# EAGLE design ChristmasTree (EAGLE 9.6.2)
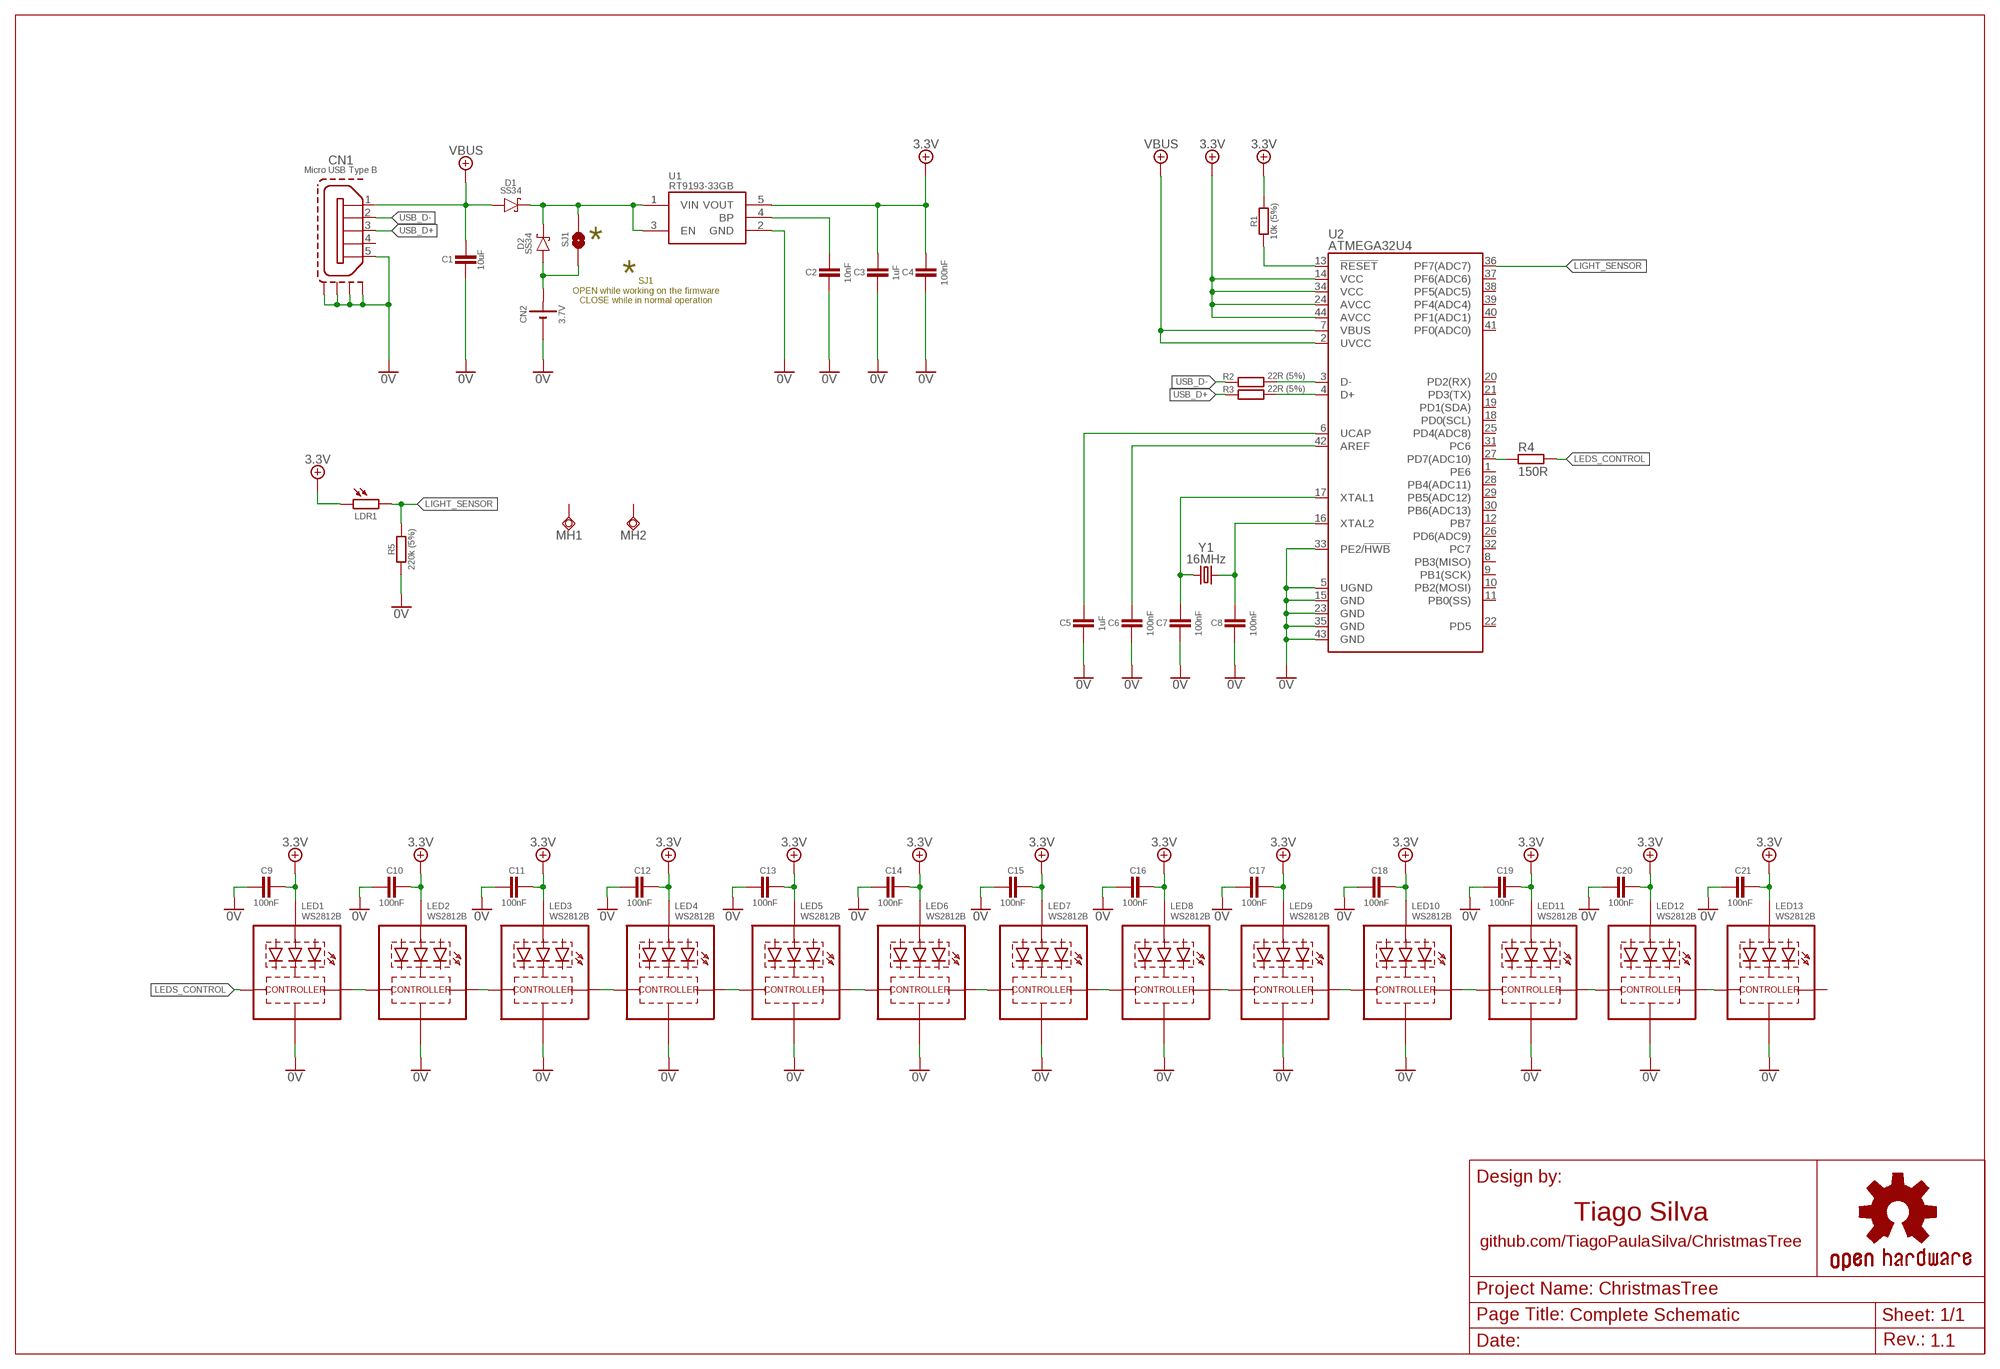
[diagram p0: schematic, sheet 1]

## Parts
C1  10uF  C_0805  [C0805]
C2  10nF  C_0603  [C0603]
C3  1uF  C_0603  [C0603]
C4  100nF  C_0603  [C0603]
C5  1uF  C_0603  [C0603]
C6  100nF  C_0603  [C0603]
C7  100nF  C_0603  [C0603]
C8  100nF  C_0603  [C0603]
C9  100nF  C_0603  [C0603]
C10  100nF  C_0603  [C0603]
C11  100nF  C_0603  [C0603]
C12  100nF  C_0603  [C0603]
C13  100nF  C_0603  [C0603]
C14  100nF  C_0603  [C0603]
C15  100nF  C_0603  [C0603]
C16  100nF  C_0603  [C0603]
C17  100nF  C_0603  [C0603]
C18  100nF  C_0603  [C0603]
C19  100nF  C_0603  [C0603]
C20  100nF  C_0603  [C0603]
C21  100nF  C_0603  [C0603]
CN1  Micro USB Type B  MICRO-USB  [10118193-0001LF]
CN2  3.7V  CELL-CONNECTOR  [JST-PH2]
D1  SS34  [DO214AB]
D2  SS34  [DO214AB]
LDR1  A1050_09  [T0-46-A10XX]
LED1  WS2812B  [5050]
LED2  WS2812B  [5050]
LED3  WS2812B  [5050]
LED4  WS2812B  [5050]
LED5  WS2812B  [5050]
LED6  WS2812B  [5050]
LED7  WS2812B  [5050]
LED8  WS2812B  [5050]
LED9  WS2812B  [5050]
LED10  WS2812B  [5050]
LED11  WS2812B  [5050]
LED12  WS2812B  [5050]
LED13  WS2812B  [5050]
MH1  TPSQTP20R  [TP20R]
MH2  TPSQTP20R  [TP20R]
R1  10k (5%)  R_0603  [R0603]
R2  22R (5%)  R_0603  [R0603]
R3  22R (5%)  R_0603  [R0603]
R4  150R  R_0603  [R0603]
R5  220k (5%)  R_0603  [R0603]
SJ1  SJ  [SJ]
U1  RT9193-33GB  [SOT94P279X129-5N]
U2  ATMEGA32U4  TESTING_ATMEGA32U4QFN  [TESTING_QFN-44]
Y1  16MHz  KX-9A  [5.0X3.2_KX-9A]

## Nets
0V: C1.2 C2.2 C3.2 C4.2 C5.2 C6.2 C7.2 C8.2 C9.2 C10.2 C11.2 C12.2 C13.2 C14.2 C15.2 C16.2 C17.2 C18.2 C19.2 C20.2 C21.2 CN1.5 CN1.MP1(S1) CN1.MP2(S2) CN1.MP3(S3) CN1.MP4(S4) CN2.2(-) LED1.3-GND(GND) LED2.3-GND(GND) LED3.3-GND(GND) LED4.3-GND(GND) LED5.3-GND(GND) LED6.3-GND(GND) LED7.3-GND(GND) LED8.3-GND(GND) LED9.3-GND(GND) LED10.3-GND(GND) LED11.3-GND(GND) LED12.3-GND(GND) LED13.3-GND(GND) R5.1 U1.2(GND) U2.5(UGND) U2.15(GND) U2.23(GND) U2.33(PE2/!HWB) U2.35(GND) U2.43(GND)
3.3V: C3.1 C4.1 C9.1 C10.1 C11.1 C12.1 C13.1 C14.1 C15.1 C16.1 C17.1 C18.1 C19.1 C20.1 C21.1 LDR1.1 LED1.1-VDD(VDD) LED2.1-VDD(VDD) LED3.1-VDD(VDD) LED4.1-VDD(VDD) LED5.1-VDD(VDD) LED6.1-VDD(VDD) LED7.1-VDD(VDD) LED8.1-VDD(VDD) LED9.1-VDD(VDD) LED10.1-VDD(VDD) LED11.1-VDD(VDD) LED12.1-VDD(VDD) LED13.1-VDD(VDD) R1.2 U1.5(VOUT) U2.14(VCC) U2.24(AVCC) U2.34(VCC) U2.44(AVCC)
LEDS_CONTROL: LED1.4-DIN(DI) R4.2
LIGHT_SENSOR: LDR1.2 R5.2 U2.36(PF7(ADC7))
N$1: LED3.2-DOUT(DO) LED4.4-DIN(DI)
N$2: LED1.2-DOUT(DO) LED2.4-DIN(DI)
N$3: R4.1 U2.27(PD7(ADC10))
N$4: LED2.2-DOUT(DO) LED3.4-DIN(DI)
N$5: LED5.2-DOUT(DO) LED6.4-DIN(DI)
N$6: LED8.2-DOUT(DO) LED9.4-DIN(DI)
N$7: LED6.2-DOUT(DO) LED7.4-DIN(DI)
N$8: LED10.2-DOUT(DO) LED11.4-DIN(DI)
N$9: LED9.2-DOUT(DO) LED10.4-DIN(DI)
N$10: LED12.2-DOUT(DO) LED13.4-DIN(DI)
N$11: LED4.2-DOUT(DO) LED5.4-DIN(DI)
N$12: R3.2 U2.4(D+)
N$13: LED11.2-DOUT(DO) LED12.4-DIN(DI)
N$14: LED7.2-DOUT(DO) LED8.4-DIN(DI)
N$15: C7.1 U2.17(XTAL1) Y1.1
N$16: C8.1 U2.16(XTAL2) Y1.3
N$17: C5.1 U2.6(UCAP)
N$18: C6.1 U2.42(AREF)
N$19: CN2.1(+) D2.A SJ1.1
N$20: R2.2 U2.3(D-)
N$21: C2.1 U1.4(BP)
RESET: R1.1 U2.13(!RESET)
USB_D+: CN1.3 R3.1
USB_D-: CN1.2 R2.1
VBAT: D1.C(K) D2.C(K) SJ1.2 U1.1(VIN) U1.3(EN)
VBUS: C1.1 CN1.1 D1.A U2.2(UVCC) U2.7(VBUS)
Unconnected: CN1.4 LED13.2-DOUT(DO) MH1.TP MH2.TP U2.1(PE6) U2.8(PB3(MISO)) U2.9(PB1(SCK)) U2.10(PB2(MOSI)) U2.11(PB0(SS)) U2.12(PB7) U2.18(PD0(SCL)) U2.19(PD1(SDA)) U2.20(PD2(RX)) U2.21(PD3(TX)) U2.22(PD5) U2.25(PD4(ADC8)) U2.26(PD6(ADC9)) U2.28(PB4(ADC11)) U2.29(PB5(ADC12)) U2.30(PB6(ADC13)) U2.31(PC6) U2.32(PC7) U2.37(PF6(ADC6)) U2.38(PF5(ADC5)) U2.39(PF4(ADC4)) U2.40(PF1(ADC1)) U2.41(PF0(ADC0))

## Notes on the sheet
- *
- *
- SJ1
  OPEN while working on the firmware
  CLOSE while in normal operation
- .
- .
- Tiago Silva
- github.com/TiagoPaulaSilva/ChristmasTree
- Complete Schematic
- 1.1

## Library data of the parts
C1-C21 = My-RLC:C_: NON-POLARIZED CAP
CN1 = My-Connectors:MICRO-USB: Micro USB Type B Connector - Standard, Shell Through Hole Source: http://www.hirose.co.jp/cataloge_hp/ed_ZX_20140804.pdf; PN: 10118193-0001LF
CN2 = My-Battery:CELL-CONNECTOR
D1 D2 = My-Diodes:SS34
LDR1 = photo-elements:A10: Sensor Robust Light Sensing Applications Outdoor Light Sensing Application Source: http://optoelectronics.perkinelmer.com/content/Datasheets/DTS_PhotocellsA1050.pdf
LED1-LED13 = My-LED:WS2812B: Intelligent control circuit and RGB chip integrated in a single 5050 package, providing a complete control of pixel point
MH1 MH2 = testpad:TPSQ: Test pad
R1-R5 = My-RLC:R_: RESISTOR
SJ1 = jumper:SJ: SMD solder JUMPER
U1 = RT9193-33GB:RT9193-33GB: RT9193 Series 300 mA 3.3 V Ultra-Low Noise Ultra-Fast CMOS LDO Regulator-SC-70-5; AVAILABILITY: Unavailable; DESCRIPTION: Linear Voltage Regulator IC 1 Output 300mA SOT-23-5; MF: Richtek USA; MP: RT9193-33GB; PACKAGE: SOT-23-5 Richtek; PRICE: None
U2 = SparkFun_Pro_Micro_v13a:TESTING_ATMEGA32U4: Atmel 44-pin 8-bit Microcontroller with 32KBytes of ISP Flash and USB Controller
Y1 = crystal-geyer_V1_0:KX: Quartz Crystals (MHz) SMD: KX - Serie Model Size l/w/h [mm] Frequency Range Frequency Stability Temp. Range [°C] Load Capacitance AECQ 200 availabel Datasheet KX-4 KX-5 KX-6 KX-7 KX-9A KX-9B KX-12A KX-12B KX-13 KX-20 KX-K KX-KS 1.6/1.2/0.3 2.0/1.6/0.45 2.5/2.0/0.55 3.2/2.5/0.8 5.0/3.2/1.0 5.0/3.2/1.1 6.0/3.5/1.1 6.0/3.5/1.0 7.0/5.0 /1.3 11.6/5.5/1.6 12.3/4.5/4.2 12.3/4.5/3.2 24.0 ~ 80.0 MHz 16.0 ~ 80.0 MHz 12.0 ~ 80.0 MHz 8.0 ~ 60.0 MHz 7,68 ~ 300,0 MHz 8,0 ~ 50,0 MHz 8,0 ~ 150,0 MHz 8,0 ~ 50,0 MHz 6,0 ~ 160,0 MHz 3,579 ~ 25,0 MHz 3,579 ~ 70,0 MHz 3,579 ~ 70,0 MHz ±10 … ±50ppm ±10 … ±50ppm ±10 … ±50ppm ±10 … ±50ppm ±10 … ±50ppm ±10 … ±50ppm ±10 … ±50ppm ±10 … ±50ppm ±10 … ±50ppm ±50ppm ±10 … ±50ppm ±10 … ±50ppm (*) -40°C …+85°C (*) -40°C …+125°C (*) -40°C …+125°C (*) -40°C …+125°C (*) -40°C …+105°C (*) -40°C …+105°C (*) -40°C …+125°C (*) -40°C …+105°C (*) -40°C …+105°C (*) -40°C …+105°C (*) -40°C …+85°C (*) -40°C …+85°C 8, 8…16 8, 8…16 10, 8…16 12, 7…20 16, 10…20 16, 10…20 16, 10…20 16, 12…20 16, 12…20 16, 12…20 16, 12…30 16, 12…30 - yes yes yes - - - - - - - - KX-4.pdf <http://www.geyer-electronic.de/uploads/tx_userartikelfrequenz/GEYER-KX-4.pdf> KX-5.pdf <http://www.geyer-electronic.de/uploads/tx_userartikelfrequenz/GEYER-KX-5.pdf> KX-6.pdf <http://www.geyer-electronic.de/uploads/tx_userartikelfrequenz/GEYER-KX-6.pdf> KX-7.pdf <http://www.geyer-electronic.de/uploads/tx_userartikelfrequenz/GEYER-KX-7.pdf> KX-9A.pdf <http://www.geyer-electronic.de/uploads/tx_userartikelfrequenz/GEYER-KX-9A.pdf> KX-9B.pdf <http://www.geyer-electronic.de/uploads/tx_userartikelfrequenz/GEYER-KX-9B.pdf> KX-12A.pdf <http://www.geyer-electronic.de/uploads/tx_userartikelfrequenz/GEYER-KX-12A.pdf> KX-12B.pdf <http://www.geyer-electronic.de/uploads/tx_userartikelfrequenz/GEYER-KX-12B.pdf> KX-13.pdf <http://www.geyer-electronic.de/uploads/tx_userartikelfrequenz/GEYER-KX-13.pdf> KX-20.pdf <http://www.geyer-electronic.de/uploads/tx_userartikelfrequenz/GEYER-KX-20.pdf> KX-K.pdf <http://www.geyer-electronic.de/uploads/tx_userartikelfrequenz/GEYER-KX-K.pdf> KX-KS.pdf <http://www.geyer-electronic.de/uploads/tx_userartikelfrequenz/GEYER-KX-KS.pdf> <http://www.geyer-electronic.de/fileadmin/template/img/logo-geyer-electronic.png> Details see: http://www.geyer-electronic.de/Frequenz-Produkte.9.0.html Created 2016-06-07, Hans Locher 2016 (C) Geyer Quartz Technology KX4,KX5,KX6,KX7,KX9A,KX9B,KX12A,KX12B,KX13,KX20,KXK,KXKS;1612;2016;2520;3225;5032;6035;7050;11655;12345;1,6x1,2;2,0x1,6;2,5x2,0;3,2x2,5;5,0x3,2;6,0x3,5;7,0x5,0;11,6x5,5;12,3x4,5;12,3x4,5;1.6x1.2;2.0x1.6;2.5x2.0;3.2x2.5;5.0x3.2;6.0x3.5;7.0x5.0;11.6x5.5;12.3x4.5;12.3x4.5;

## Net classes
0 default: width 0.203 mm

## Board
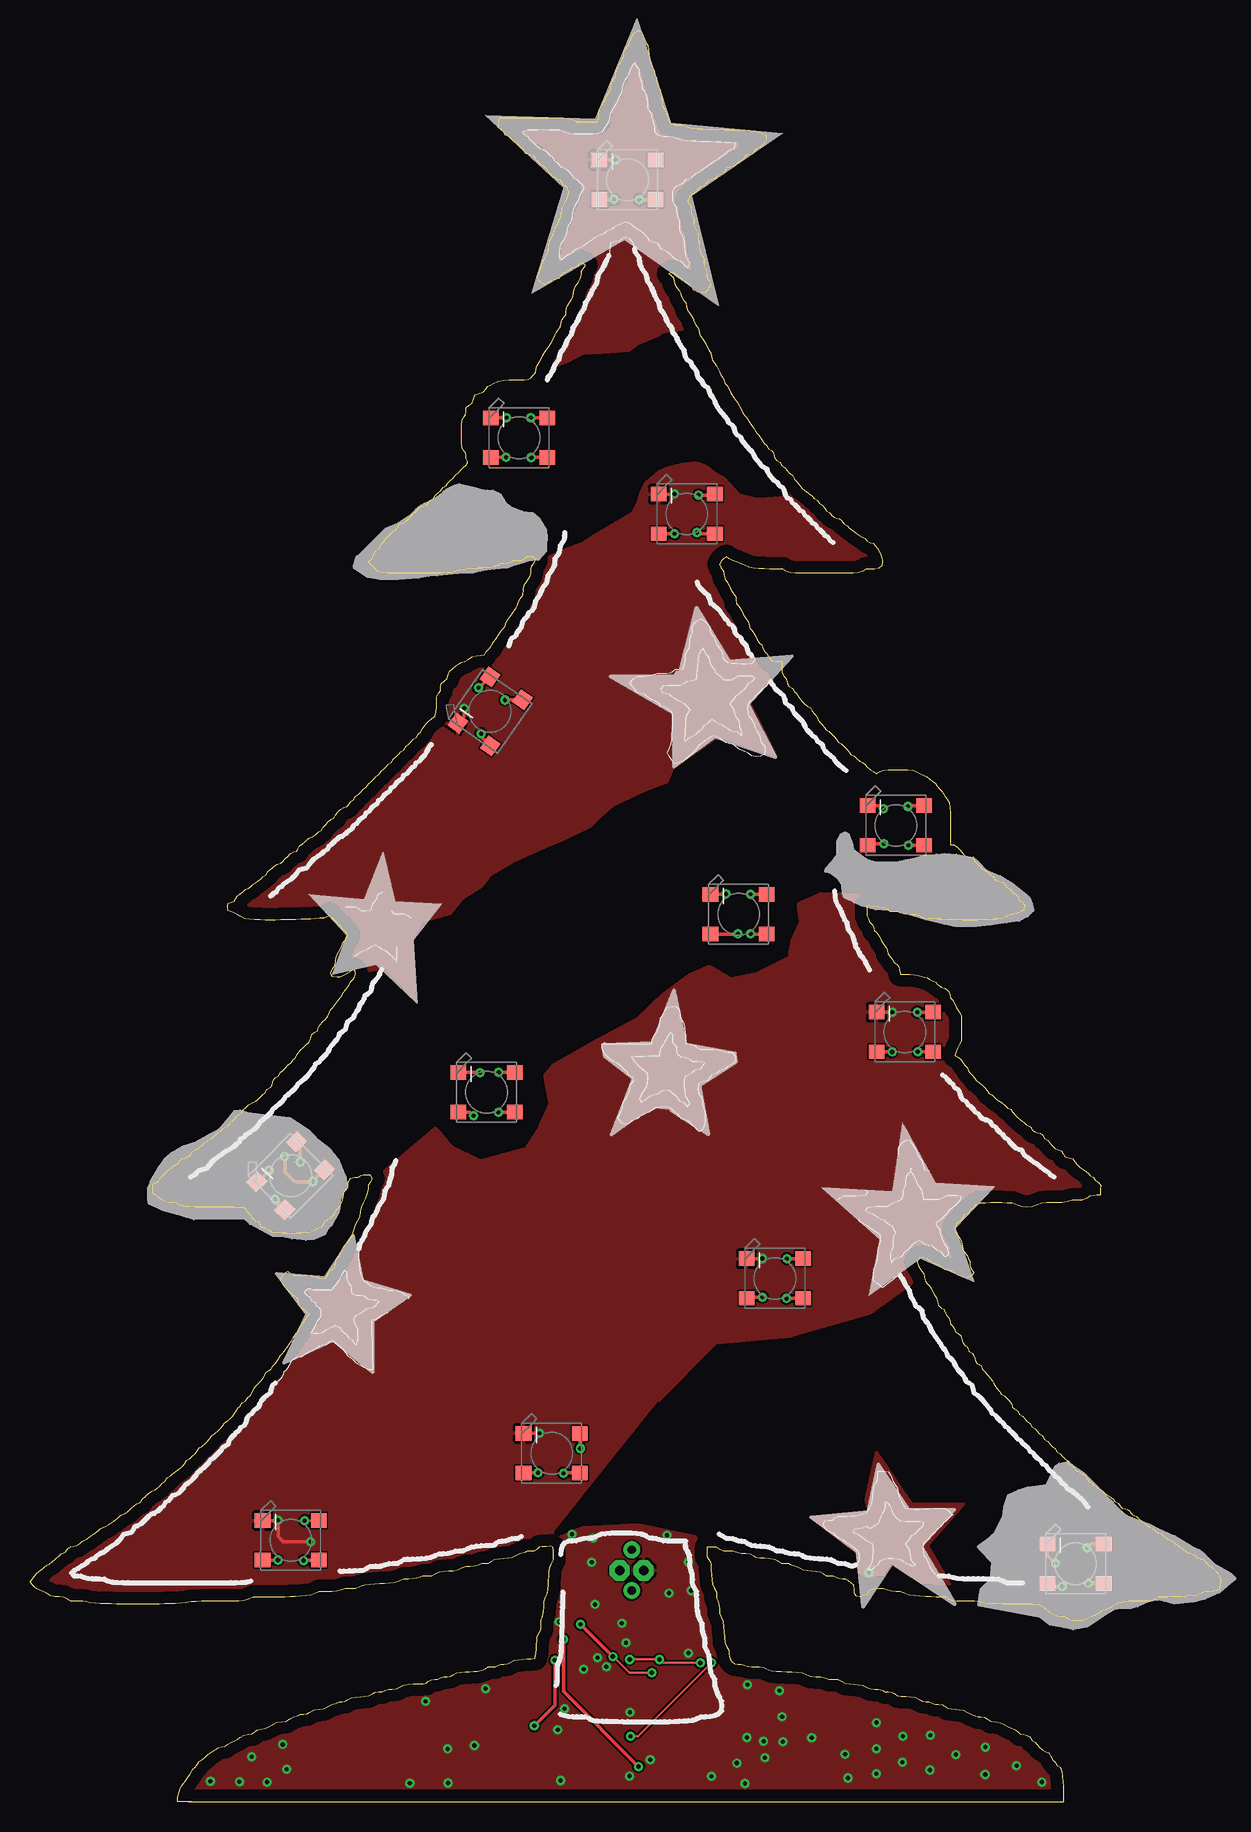
[diagram p1: board, top side]
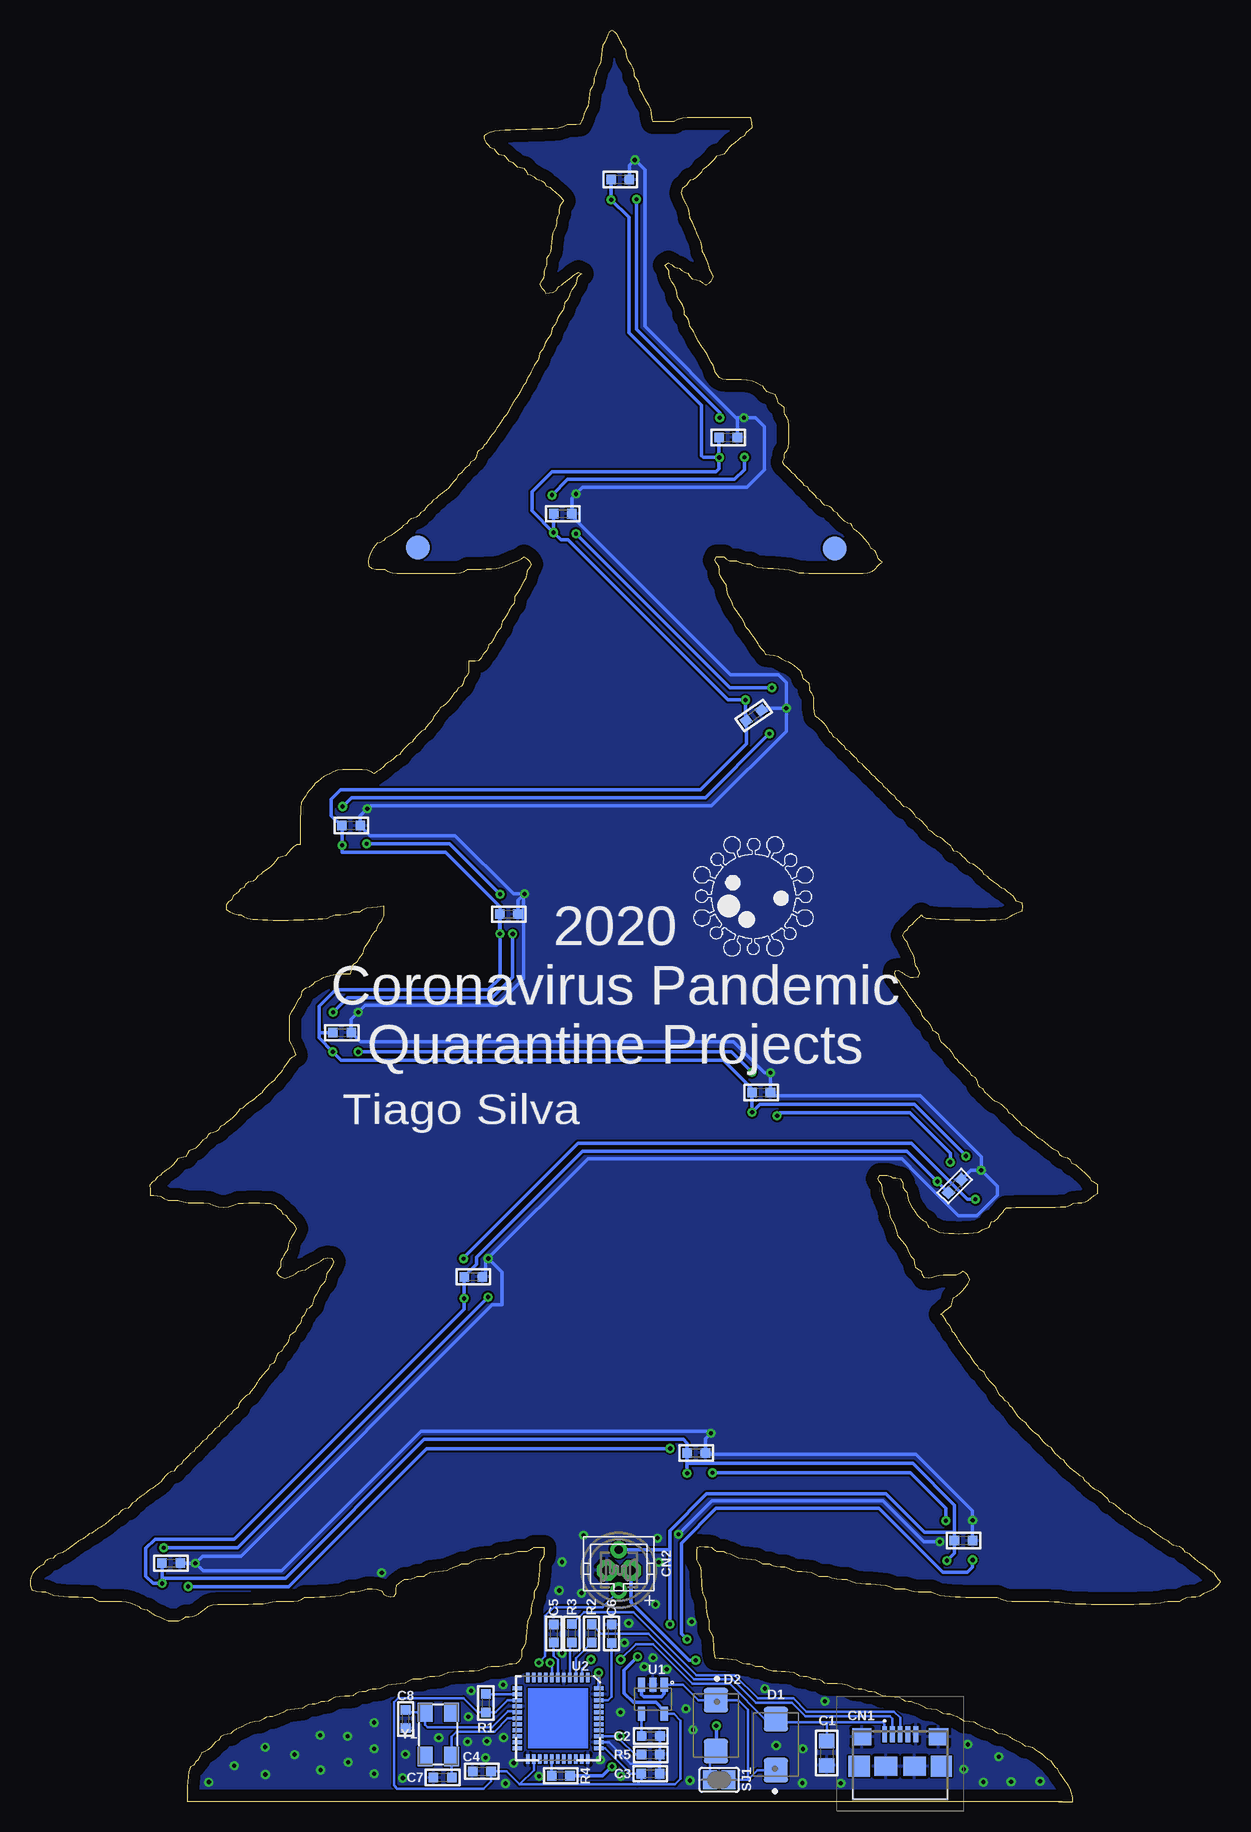
[diagram p2: board, bottom side, seen from below]

Size 99.25 x 147.66 mm. Coordinates in mm from the lower left corner, seen from the top.
Outline: 2001 segments
Copper layers (1*16): Top 0.035mm / dielectric 1.5mm / Bottom 0.035mm
Design rules "default *": minimum track width 6mil, minimum drill 0.35mm, track to track 6mil, track to pad 6mil, pad to pad 6mil, via to via 6mil, smd to smd 6mil, copper to edge 40mil, drill to drill 6mil, minimum pad ring 10mil, minimum via ring 8mil, stop-mask expansion 4mil, vias tented up to drill 15mil, thermal gap 10mil
tKeepout: area 52.9,88.3 to 60.6,96.4
tRestrict: area 43.7,15.6 to 69.4,33.3; area 52.4,23.8 to 69.8,38.7; area 69.4,15.6 to 77.1,19.8; area 63.7,15.1 to 99.6,43.7; area 10.1,47 to 83.2,93.8; area 27.4,102.2 to 64.5,122.5

### Footprints (pad centres in the part's own frame; a part is rotated, then mirrored left to right if it is on the bottom)
C0805 = smd 1.2 x 1.3: 1 -1.016,0; 2 1.016,0
C0603 = smd 0.8 x 0.8: 1 -0.762,0; 2 0.762,0
10118193-0001LF = smd 1.35 x 0.4: 1 1.33,1.3; 2 1.33,0.65; 3 1.33,0; 4 1.33,-0.65; 5 1.33,-1.3 | smd 1.4 x 1.6: MP1 1.105,3.2; MP4 1.105,-3.2 | smd 1.6 x 1.9: MP2 -1.345,1.2; MP3 -1.345,-1.2 | smd 1.778 x 1.778: P$1 -1.346,3.429; P$2 -1.346,-3.429
JST-PH2 = drill 0.813 pad 1.676 octagon: 1 1,0; 2 -1,0
DO214AB = smd 2.06 x 2.02: A 2.125,0; C -2.125,0
T0-46-A10XX = drill 0.7 pad 1.4: 1 -1.7,0; 2 1.7,0
5050 = smd 1.3 x 1.2: 1-VDD 2.35,-1.65; 2-DOUT 2.35,1.65; 3-GND -2.35,1.65; 4-DIN -2.35,-1.65
TP20R = smd 2 x 2: TP 0,0
R0603 = smd 0.8 x 0.8: 1 -0.762,0; 2 0.762,0
SJ = smd 1.168 x 1.6: 1 -0.762,0; 2 0.762,0
SOT94P279X129-5N = smd 1.17 x 0.67: 1 -1.22,0.94; 2 -1.22,0; 3 -1.22,-0.94; 4 1.22,-0.94; 5 1.22,0.94
TESTING_QFN-44 = smd 0.8 x 0.3: 1 -3.4,2.5; 2 -3.4,2; 3 -3.4,1.5; 4 -3.4,1; 5 -3.4,0.5; 6 -3.4,0; 7 -3.4,-0.5; 8 -3.4,-1; 9 -3.4,-1.5; 10 -3.4,-2; 11 -3.4,-2.5; 23 3.4,-2.5; 24 3.4,-2; 25 3.4,-1.5; 26 3.4,-1; 27 3.4,-0.5; 28 3.4,0; 29 3.4,0.5; 30 3.4,1; 31 3.4,1.5; 32 3.4,2; 33 3.4,2.5 | smd 0.3 x 0.8: 12 -2.5,-3.4; 13 -2,-3.4; 14 -1.5,-3.4; 15 -1,-3.4; 16 -0.5,-3.4; 17 0,-3.4; 18 0.5,-3.4; 19 1,-3.4; 20 1.5,-3.4; 21 2,-3.4; 22 2.5,-3.4; 34 2.5,3.4; 35 2,3.4; 36 1.5,3.4; 37 1,3.4; 38 0.5,3.4; 39 0,3.4; 40 -0.5,3.4; 41 -1,3.4; 42 -1.5,3.4; 43 -2,3.4; 44 -2.5,3.4
5.0X3.2_KX-9A = smd 1.6 x 1.25: 1 -1.85,-1.1; 2 1.85,-1.1; 3 1.85,1.1; 4 -1.85,1.1

### Placement (x,y rotation side)
C1  32.83,4.07 270 bottom
C2  47.49,5.5 0 bottom
C3  47.53,2.35 0 bottom
C4  61.58,2.55 180 bottom
C5  55.59,14.04 90 bottom
C6  50.76,14.02 90 bottom
C7  64.85,2.03 180 bottom
C8  67.94,6.91 270 bottom
C9  21.42,21.78 0 bottom
C10  43.7,29.09 0 bottom
C11  87.48,19.89 0 bottom
C12  62.29,43.76 0 bottom
C13  73.24,64.1 0 bottom
C14  59.32,73.98 0 bottom
C15  38.29,59.12 0 bottom
C16  22.15,51.31 45 bottom
C17  72.48,81.36 0 bottom
C18  38.92,90.53 35 bottom
C19  54.83,107.35 0 bottom
C20  41.04,113.71 0 bottom
C21  50.04,135.19 0 bottom
CN1  26.7,4.32 90 bottom
CN2  50.16,19.29 0 bottom
D1  37.06,4.77 90 bottom
D2  42.07,6.36 270 bottom
LDR1  50.17,19.32 270 bottom
LED1  21.75,21.8 0 top
LED2  43.5,29.06 0 top
LED3  87.17,19.86 0 top
LED4  62.09,43.62 0 top
LED5  21.74,52.19 45 top
LED6  38.06,59.14 0 top
LED7  72.93,64.17 0 top
LED8  59.08,73.97 0 top
LED9  72.19,81.38 0 top
LED10  38.36,90.88 55 top
LED11  54.75,107.33 0 top
LED12  40.77,113.69 0 top
LED13  49.82,135.18 0 top
MH1  32.18,104.47 0 bottom
MH2  66.91,104.54 0 bottom
R1  61.26,8.22 270 bottom
R2  52.43,14.04 270 bottom
R3  54.09,14.05 270 bottom
R4  54.99,2.19 0 bottom
R5  47.51,3.96 180 bottom
SJ1  41.8,1.85 0 bottom
U1  47.32,8.56 270 bottom
U2  55.24,6.97 270 bottom
Y1  65.22,5.63 90 bottom

### Tracks (layer width: path | path; a pad name or v marks a point on that pad's centre or on a via)
0V  (via drill 0.35)
  Top 0.305: LED1.3-GND 20.66,23.45 v20.67,23.46 20.67,22.12 21.11,21.68 v23.4,21.68 | LED2.3-GND v42.46,30.71 v42.47,30.73 | v85.47,19.89 84.82,20.54 LED3.3-GND | LED4.3-GND 61.03,45.27 v61.05,45.29 | LED6.3-GND 37.51,60.79 v37.53,60.77 | LED7.3-GND v71.87,65.82 v71.88,65.81 | LED8.3-GND 57.98,75.62 v58.03,75.67 | LED9.3-GND 70.87,83.03 v71.13,82.76 | LED10.3-GND 36.2,90.44 v36.2,91.15 | LED11.3-GND 53.71,108.98 v53.72,109 | LED12.3-GND v39.72,115.34 v39.73,115.35 | LED13.3-GND v48.82,136.83 v48.83,136.83 | v19.96,52.65 19,51.69 LED5.3-GND
  Bottom 0.203: C3.2 46.75,2.36 46.75,3.19 | 46.75,3.19 R5.1 46.75,5.48 C2.2 | 46.75,3.19 49.21,3.19 51,4.98 U2.35
  Bottom 0.305: C21.2 49.28,136.38 v48.83,136.83 48,136 48,122.96 40.39,115.35 v39.73,115.35 | C20.2 40.27,115.35 v39.73,115.35 | C18.2 38.11,91.15 v36.2,91.15 | C14.2 58.56,75.13 v58.03,75.67 | C13.2 72.48,65.21 v71.88,65.81 | C12.2 61.28,44.01 61.28,45.06 v61.05,45.29 | C9.2 v20.67,23.46 20.67,24.25 25.41,28.99 42.84,28.99 C10.2 42.94,30.26 v42.47,30.73 42.47,30.79 42.58,30.9 66.64,30.9 78.29,19.25 84.82,19.25 v85.47,19.89 C11.2 85.47,19.89 v85.47,19.89 84.86,20.49 81.65,20.49 60.72,41.42 59.9,41.42 59.9,44.14 v61.05,45.29 | v36.2,91.15 36.2,89.23 42.43,83 70.89,83 v71.13,82.76 71.72,82.18 C17.2 70.88,80.53 63.82,80.53 58.96,75.67 v58.03,75.67 | v39.73,115.35 38.79,115.35 38.02,114.59 38.02,111.01 39.48,109.55 53.18,109.55 v53.72,109 54.07,108.66 C19.2 54.07,107.15 40.86,93.94 36.87,93.94 36.2,93.28 v36.2,91.15 | v71.88,65.81 71.31,66.38 60.34,66.38 58.11,68.61 58.11,75.58 v58.03,75.67 | v71.88,65.81 72.47,65.22 72.47,64.13 71.67,63.33 40.6,63.33 38.04,60.77 v37.53,60.77 C15.2 37.24,58.84 25.02,58.84 19.96,53.77 v19.96,52.65 | v61.05,45.29 52.74,53.59 26.57,53.59 25.91,52.94 25.83,52.79 21.87,48.84 20.32,48.84 18.6,50.55 18.6,51.3 v19.96,52.65 | C16.2 20.81,52.65 v19.96,52.65 | v23.4,21.68 24.75,21.68 28.14,25.08 42.42,25.08 v45.2,22.3
  other vias: 70.57,4.43 70.57,2.34 70.57,6.62 72.78,5.47 72.73,3.32 75.07,5.55 75.02,2.66 77.2,3.94 79.65,4.57 79.62,2.28 82.24,3.02 62.77,5.02 84.34,1.66 58.92,3.24 59.76,5.37 61.16,5.07 61.27,3.68 59.6,1.54 51.71,3.52 37.04,4.7 44.24,1.79 44.56,7.77 43.99,6.02 50.02,7.46 47.3,12.01 49.68,13.26 49.34,14.9 59.81,9.76 62.48,9.25 62.7,7.1 65.17,5.35 68.18,1.99 67.95,3.97 15.04,1.72 17.46,1.69 19.77,1.65 18.49,3.76 21.08,4.79 21.4,2.73 34.85,1.58 34.8,4.42 31.66,1.55 32.99,8.38 37.97,9.44 49.98,2.16 56.81,2.13 44.09,15.02 47.12,16.46 46.83,19.98 46.93,21.99 53.11,22.22 54.89,19.99 53.27,17.41 55.13,17.62 48.05,11.27 46.16,11.05 54.9,12.4 69.93,19.1
  pour Bottom: 12.3,-0.01 86.08,-0.01 86.15,0.07 86.12,2.58 84.72,4.16 82.45,6.03 78.61,7.43 72.51,9.03 64.25,10.81 58.51,11.56 56.41,21.07 55.62,22.21 54.93,22.76 53.72,23.02 52.18,23.22 50.38,23.28 48.81,23.19 47.31,23.02 45.61,22.99 44.95,22.5 43.61,21.91 43.64,20.99 42.07,11.84 39.44,11.6 35.48,10.71 30.58,9.63 25.38,8.14 19.99,6.51 15.87,4.54 13.97,3.43 13.02,1.76 12.2,0.19 12.33,0
  pour Top: 12.29,-0.01 86.06,-0.01 86.13,0.06 86.11,2.58 84.71,4.15 82.44,6.02 78.59,7.42 72.49,9.02 64.23,10.8 58.5,11.55 56.39,21.06 55.61,22.2 54.92,22.75 53.71,23.01 52.17,23.21 50.37,23.27 48.8,23.18 47.29,23.01 45.59,22.98 44.94,22.49 43.6,21.9 43.63,20.98 42.06,11.83 39.43,11.6 35.47,10.7 30.56,9.62 25.36,8.13 19.98,6.5 15.85,4.53 13.96,3.42 13.01,1.75 12.19,0.18 12.32,-0.01
  pour Top: 56.4,21.24 57.22,21.24 57.76,20.92 58.86,20.73 60.17,20.56 60.55,20.37 61.91,20.18 63.41,19.67 64.48,19.31 65.62,19.16 66.36,18.99 67.29,18.67 68.06,18.52 68.57,18.31 68.86,17.53 68.9,17.16 69.67,17.04 70.09,17.52 70.9,17.71 72.46,17.49 73.49,17.22 74.72,17 75.81,16.97 77.14,16.64 78.32,16.59 79.79,16.53 80.66,16.34 81.64,16.4 82.71,16.43 83.99,16.48 85.05,15.88 85.62,15.44 87.15,14.93 88.13,15.04 89.11,15.5 89.93,15.96 90.75,16.51 92.19,16.64 93.83,16.7 94.38,17 95.93,17.08 97.48,17.22 98.79,17.57 99.42,18.14 99.23,18.82 98.85,19.37 98.22,19.86 97.46,20.27 96.28,20.84 94.65,22.07 93.94,22.53 91.98,24.03 90.86,24.74 87.67,27.54 86.31,28.58 83.22,31.47 80.61,34.63 78.26,37.6 76.87,39.54 75.59,41.77 74.36,43.76 73.98,44.93 74.25,45.31 74.5,45.31 75.02,44.96 75.95,44.5 76.52,44.25 77.14,44.03 77.88,43.65 78.7,43.98 78.32,45.67 77.85,46.27 77.25,47.6 77.47,48.53 78.37,49.46 79.16,49.92 81.1,49.97 82.32,49.81 83.28,49.54 84.62,50 85.95,49.95 87.23,50.14 88.21,50.16 88.54,50.55 89.55,50.46 89.5,50.9 89,51.74 87.91,52.73 86.55,53.71 85.51,54.47 80.66,58.56 78.75,60.47 77.12,62.24 77.72,63.41 77.64,64.91 77.14,66.54 76.11,67.77 75.05,68.56 73.71,68.97 72.59,69 71.17,71.2 70.41,72.78 69.76,74.56 70.96,74.47 71.96,74.2 73.76,73.82 75.51,73.41 77.88,73.33 79.41,73.38 81.53,73.68 82.13,74.12 83.01,74.34 82.9,75.07 82.13,75.81 81.23,76.33 80.2,77.23 79.46,77.74 78.59,78.56 77.94,78.78 77.25,79.54 76.52,79.73 76.78,82.48 76.42,83.89 75.87,84.67 75.08,85.26 74.46,85.68 73.51,86.01 72.14,86.08 70.93,85.98 70.5,85.59 67.76,87.91 65.4,90.46 63.57,92.78 62.65,94.19 62.88,95.07 61.7,95.07 59.02,99.72 57.78,102.43 57.81,103.44 58.3,103.54 59.15,103.05 59.71,102.76 62.03,102.56 63.47,102.4 64.58,102.33 66.32,102.3 68.38,102.3 69.59,102.46 70.21,102.79 70.73,102.82 71.39,103.15 71.16,103.84 70.63,104.42 69.88,105.24 68.21,106.16 63.86,110.21 61.9,112.18 59.74,115.15 57.02,119.93 54.9,124.11 53.43,127.51 55.06,126.47 55.85,125.68 56.57,125.85 56.66,126.5 56.4,127.38 56.17,128.59 55.72,130.92 54.83,133.34 61.51,138.5 61.28,138.96 59.97,139.26 53.36,139.81 50.97,147.46 50.84,147.63 50.42,147.37 49.6,145.73 47.31,140.01 45.15,140.07 44.4,140.3 39.16,140.14 39.19,139.55 40.57,138.18 42.11,136.87 43.81,135.53 44.92,134.32 44.2,132.06 43.22,129.44 42.53,127.35 42.33,126.76 42.89,126.21 43.84,126.83 44.49,127.22 45.57,127.87 46.26,128.14 45.74,126.63 43.48,121.53 42.2,119.37 41.71,118.59 39.36,118.36 38.31,118.13 37.69,117.54 36.9,116.89 36.71,116.3 36.05,115.58 35.89,114.01 36.15,112.5 36.48,111.39 32.65,107.73 30.52,106.03 29.31,104.98 28.49,103.84 28.36,102.99 29.12,102.23 31.64,102.23 35.4,102.4 38.77,102.99 41.58,103.54 42.07,103.35 41.68,102.56 40.14,98.77 38.02,95.5 36.48,95.2 35.27,94.29 34.45,93.3 33.83,91.6 33.79,90.66 31.9,88.5 25.94,82.61 21.07,78.39 17.67,75.71 16.23,74.56 16.72,74.07 18.84,73.35 20.68,73.35 23.59,73.39 24.96,73.91 26.47,72.31 25.09,69.23 25.19,68.65 25.88,68.74 27.02,69.43 27.25,68.91 25.98,66.78 22.61,62.69 20.48,60.27 20.02,59.19 16.88,56.77 13.71,54.32 11.58,52.82 10.44,51.41 10.27,50.56 11.22,49.91 12.99,49.61 15.51,49.48 17.96,49.48 19.04,48.37 19.5,47.88 21.1,47.22 22.38,47.16 24.34,47.78 25.16,48.56 26.11,50.2 26.4,51.34 26.76,52.1 27.78,52.46 28.3,52.46 28.53,51.77 28.23,50.92 27.68,49.22 26.01,45.82 25.39,44.38 24.77,43.66 23.49,43.72 21.95,43.66 21.46,44.18 21,43.59 21.23,42.74 22.31,41.53 23.19,40.55 18.84,34.44 14.85,30.15 11.81,27.27 8.7,24.69 5.36,22.47 4.38,21.48 3.2,21.16 2.84,20.73 1.27,19.85 0.06,18.7 0.23,18.21 1.27,17.33 3.04,16.87 6.64,16.51 12.23,16.48 18.35,16.71 18.97,17.17 22.21,17.04 24.34,17.46 26.96,17.99 30.98,18.21 34.25,19.06 37.3,19.75 40.27,20.44 42.37,21.06 43.55,21.27 44.43,23.7 50.32,23.74 54.73,23.48 56.34,22.73 56.5,21.26
  pour Bottom: 12.3,-0.07 86.16,0 86.24,1.96 85.85,2.76 84.57,4.35 82.4,5.94 77.1,7.8 71.75,8.99 67.24,9.96 62.2,10.89 58.66,11.46 57.91,12.74 57.47,15.48 56.94,17.78 56.54,20.12 56.32,21.19 59.11,20.48 61.1,20.12 63.26,19.64 65.6,19.06 68.43,18.14 68.65,17.25 69.1,16.72 69.98,16.99 70.51,17.65 71.57,18.14 72.37,18.27 74.93,17.3 76.57,17.12 78.47,16.68 80.63,16.19 82.75,16.06 83.9,16.24 85.27,15.79 86.91,14.95 88.19,14.91 89.07,15.57 91.15,16.32 91.68,16.5 93.71,16.68 95.53,16.85 96.63,17.21 98.27,17.43 99.59,18 99.59,18.4 99.28,19.29 91.84,24.33 87.29,27.86 83.53,31.31 80.35,35.33 76.9,39.44 74.42,43.91 74.11,44.93 74.42,45.41 74.95,45.06 76.59,44.22 77.74,43.78 78.54,43.56 78.71,44.04 78.45,44.66 78.14,45.85 77.39,47.14 77.17,47.53 77.59,48.99 79.21,49.87 81.24,49.91 82.82,49.72 83.74,49.54 84.51,49.91 86.02,49.91 87.42,50.06 88.6,50.31 89.45,50.68 89.34,51.42 79.87,59.08 77.11,62.32 77.7,63.79 77.66,65.19 76.96,66.7 75.9,68.03 74.21,68.96 72.78,68.98 72.52,68.96 69.85,73.69 69.73,74.67 70.99,74.43 71.94,74.21 73.41,73.94 75.44,73.48 76.97,73.45 78.54,73.42 80.38,73.57 81.42,73.75 82.46,74.06 82.96,74.49 82.77,75.07 82.07,75.75 78.22,78.85 76.96,79.63 76.82,79.7 76.82,82.57 76.26,84.05 74.83,85.3 73.72,85.92 71.92,86.14 70.52,85.63 63.6,92.75 62.63,93.86 62.76,95.09 61.83,95.14 58.66,100.18 57.88,102.2 57.59,103.19 57.92,103.56 58.92,103.34 60.09,102.94 61.49,102.75 62.97,102.61 64.48,102.35 66.32,102.35 68.09,102.27 69.01,102.46 70.11,102.75 70.92,102.79 71.44,103.19 70.7,104.52 69.74,105.37 68.34,106.07 67.17,106.99 63.11,110.74 61.71,112.44 59.98,114.83 57.52,118.59 56.15,121.57 54.13,125.73 53.24,127.2 53.68,127.32 54.5,126.76 55.31,126.14 56.04,125.55 56.45,125.73 56.59,126.62 56.37,127.72 54.85,133.46 61.57,138.51 61.16,139.1 55.34,139.5 53.35,139.76 50.96,147.68 50.26,147.27 49.67,145.54 49.19,144.37 48.42,142.67 47.46,140.5 47.39,140.02 45.58,139.87 44.37,140.28 38.91,140.28 38.95,139.47 44.85,134.39 42.16,127.06 42.6,126.32 43.41,126.73 44.51,127.43 45.32,127.98 46.02,128.27 46.43,128.09 41.83,118.6 39.97,118.46 38.74,118.38 38.18,117.92 37.69,117.48 36.93,117.23 36.67,116.64 36.08,116.05 36.29,115.41 35.9,113.47 36.31,112.5 36.42,111.76 34.42,109.33 32.17,107.44 30.46,105.9 29.18,104.78 28.51,103.65 28.44,103.37 28.72,102.68 29.46,102.35 31.1,102.37 32.89,102.27 34.96,102.25 36.65,102.6 38.64,102.91 39.82,103.22 41.25,103.65 42.14,103.63 41.63,102.37 38.97,96.88 37.63,95.33 35.75,94.93 34.15,92.88 33.71,90.54 28.08,84.55 25.7,82.32 23.31,79.93 20.02,77.71 16.78,75.21 16.14,74.36 17.21,73.78 18.69,73.67 20.18,73.52 23.57,73.36 25.22,73.73 26.49,72.19 25.59,70.28 25.17,69.11 25.48,68.53 26.49,69.17 27.13,68.9 21.28,60.83 14.55,54.89 11.94,52.47 10.29,51.2 12.26,49.86 14.55,49.48 17.48,49.22 18.95,48.14 22.71,47.25 24.62,47.57 25.95,49.86 26.97,51.96 28.44,51.96 25,43.55 23.94,43.71 22.61,43.6 21.39,44.08 20.91,43.07 22.45,41.85 22.93,40.52 16.91,32.33 13.93,28.58 11.02,25.75 5.98,22.77 0.4,19.56 0.71,17.35 4.53,16.58 11.02,16.12 16.45,16.43 23.09,17.5 27.6,17.73 32.49,18.57 38.45,20.1 41.89,20.63 43.57,20.56 42.81,18.26 41.81,16.05 42.27,12.76 41.51,11.69 36.54,10.62 22.48,7.64 22.35,7.54 16.53,4.88 12.65,2 12.29,-0.06
3.3V  (via drill 0.35)
  Top 0.203: v51.84,10.77 49.98,10.77 48.64,12.11 v48.59,12.11
  Top 0.305: LED1.1-VDD 22.84,20.15 v22.81,20.11 | LED2.1-VDD 44.48,27.41 v44.47,27.4 | LED3.1-VDD v88.23,18.21 | LED4.1-VDD 63.08,41.97 v63.06,41.96 | LED6.1-VDD 39.07,57.49 v39.05,57.47 | LED7.1-VDD v74.01,62.52 v74,62.51 | LED8.1-VDD 60.1,72.32 v60.08,72.34 | v73.23,79.73 v73.24,79.73 LED9.1-VDD | LED10.1-VDD 41.03,91.83 v39.61,91.83 | LED11.1-VDD 55.7,105.68 v55.6,105.78 | LED12.1-VDD v41.79,112.04 | LED13.1-VDD 50.81,133.53 v50.8,133.52 | v48.59,12.11 45.96,14.75 45.96,14.8 v45.9,14.8 | v21.22,53.82 21.22,52.57 22.09,51.7 v23.61,51.7 23.61,51.73 LED5.1-VDD
  Bottom 0.203: U2.34 51.33,4.47 49.2,2.35 C3.1 48.29,1.8 48.63,1.47 | 58.42,1.47 58.45,1.47 59.53,2.55 C4.1 60.82,1.72 61.42,1.12 68.65,1.12 68.91,1.38 68.91,8.31 68.57,8.65 63.12,8.65 61.93,7.46 R1.2 60.44,7.46 59.43,8.47 U2.14 | U2.24 57.24,2.65 58.42,1.47 | 48.63,1.47 58.42,1.47 | U2.44 v51.84,10.77 | U1.5 45.58,7.34 45.01,6.77 45.01,1.92 45.46,1.47 48.63,1.47
  Bottom 0.305: U1.5 46.38,7.61 47.06,8.3 48.95,8.3 49.72,9.07 49.72,10.98 v48.59,12.11 | C21.1 v50.8,133.53 v50.8,133.52 49.32,132.05 49.32,122.44 43.26,116.38 43.26,112.19 LED12.1-VDD v41.79,112.04 v41.8,112.05 | C20.1 v41.8,112.05 | C19.1 v55.6,105.78 | C14.1 v60.08,72.35 v60.08,72.34 | 44.46,28.21 v44.46,27.4 v44.47,27.4 44.47,29.9 44.77,30.2 66.38,30.2 77.93,18.65 88.24,18.65 | 44.46,28.21 C10.1 | C11.1 88.24,18.65 | 88.24,18.65 88.24,18.22 | 88.24,18.22 v88.23,18.21 | v22.81,20.11 22.18,20.74 C9.1 22.18,22.46 | v55.6,105.78 57.41,107.6 57.41,109.18 55.74,110.85 42.05,110.85 41.8,111.11 v41.8,112.05 | v60.08,72.34 60.08,74.61 64.61,79.14 73.23,79.14 v73.23,79.73 v73.24,79.74 C17.1 73.29,81.36 74.13,82.2 74.13,83.58 73.35,84.35 43.35,84.35 39.54,88.17 C18.1 39.61,90.17 v39.61,91.83 41.05,91.83 54.4,105.18 55,105.18 v55.6,105.78 | 75.15,64.11 75.15,63.67 74,62.52 v74,62.51 73.31,61.82 41.42,61.82 39.05,59.45 C15.1 v39.05,57.47 38.39,58.13 25.51,58.13 v21.21,53.83 v21.22,53.82 | 75.15,64.11 75.15,66.29 73.78,67.66 61.06,67.66 60.08,68.65 v60.08,72.34 | 88.24,18.22 88.99,18.22 89.59,18.82 89.59,21.14 88.81,21.91 82.22,21.91 63.06,41.06 v63.06,41.96 63.06,43.75 C12.1 62.02,44.8 62.02,45.4 53.2,54.22 26.14,54.22 v23.61,51.7 C16.1 | C13.1 75.14,64.1 75.15,64.11 | 22.18,22.46 22.18,24.73 25.67,28.21 44.46,28.21 | 45.9,21.02 45.9,22.62 42.85,25.66 27.91,25.66 24.71,22.46 22.18,22.46 | LDR1.1 45.9,21.02 | v45.9,14.8 45.9,21.02
LEDS_CONTROL  (via drill 0.35)
  Top 0.305: LED1.4-DIN v20.66,20.15 v20.67,20.16 | v50.74,2.95 44.47,9.21 v44.47,13.56
  Bottom 0.305: v20.67,20.16 20.67,19.58 21.12,19.12 23.14,19.12 28.48,24.47 42.05,24.47 44.94,21.57 44.94,14.04 v44.47,13.56 | R4.2 51.51,2.19 50.74,2.95 v50.74,2.95
LIGHT_SENSOR  (via drill 0.35)
  Top 0.203: v56.83,11.6 56.81,11.6 50.69,5.47 v50.05,5.47
  Bottom 0.203: R5.2 48.83,3.96 50.05,5.18 v50.05,5.47 | LDR1.2 50.17,17.58 51.54,16.21 55.58,16.21 56.3,15.49 56.3,12.13 v56.83,11.6 | U2.36 v50.05,5.47 | v50.05,5.47
N$1  (via drill 0.35)
  Top 0.305: LED3.2-DOUT 88.43,21.51 v88.11,21.19 | LED4.4-DIN 59.84,42.07 v61.06,42.07
  Bottom 0.305: v61.06,42.07 81.94,21.19 v88.1,21.19 v88.11,21.19
N$2  (via drill 0.35)
  Top 0.203: LED1.2-DOUT 22.92,23.45 v22.89,23.42
  Top 0.305: LED2.4-DIN 42.33,27.41 v42.35,27.44
  Bottom 0.305: v22.89,23.42 22.89,24.49 25.84,27.44 v42.35,27.44
N$3
  Bottom 0.203: U2.27 55.75,3.56 R4.1
N$4  (via drill 0.35)
  Top 0.305: v45.88,29.45 45.85,29.49 LED2.2-DOUT | LED3.4-DIN 85.07,17.95 v86.07,17.95
  Bottom 0.305: v45.88,29.45 46.06,29.45 46.07,29.45 66.18,29.45 77.68,17.95 v86.07,17.95
N$5  (via drill 0.35)
  Top 0.305: LED6.4-DIN 36.65,57.49 v36.97,57.17 | v22.54,53.32 22.54,54.71 LED5.2-DOUT
  Bottom 0.305: v22.54,53.32 22.54,54.04 25.92,57.42 36.72,57.42 v36.97,57.17
N$6  (via drill 0.35)
  Top 0.305: LED8.2-DOUT 60.07,75.62 v60.05,75.64 | LED9.4-DIN 69.95,79.84 v71.18,79.84
  Bottom 0.305: v71.18,79.84 64.25,79.84 v60.05,75.64
N$7  (via drill 0.35)
  Top 0.305: LED6.2-DOUT v39.08,60.79 | LED7.4-DIN 71.87,62.52 v71.88,62.5
  Bottom 0.305: v71.88,62.5 40.78,62.5 v39.08,60.79
N$8  (via drill 0.35)
  Top 0.305: LED10.2-DOUT 37.44,92.84 v37.39,92.84 | LED11.4-DIN v53.74,105.68 v53.74,105.69
  Bottom 0.305: v37.39,92.84 v37.4,92.84 40.89,92.84 v53.74,105.69
N$9  (via drill 0.35)
  Top 0.305: LED9.2-DOUT 73.26,83.03 v73.19,82.95 | LED10.4-DIN 37.6,88.78 v37.6,89.01
  Bottom 0.305: v73.19,82.95 72.44,83.69 42.95,83.69 37.63,89.01 v37.6,89.01
N$10  (via drill 0.35)
  Top 0.305: LED12.2-DOUT v41.75,115.34 v41.75,115.35 | LED13.4-DIN v48.68,133.53 v48.7,133.54
  Bottom 0.305: v48.7,133.54 48.7,122.7 41.75,115.76 v41.75,115.35
N$11  (via drill 0.35)
  Top 0.305: LED4.2-DOUT v63.11,45.27 | LED5.4-DIN 21.24,49.41 v20.43,50.22
  Bottom 0.305: v63.11,45.27 63.11,45.33 53.55,54.88 25.76,54.88 21.1,50.22 v20.43,50.22
N$12
  Bottom 0.203: U2.4 54.24,13.14 R3.2
N$13  (via drill 0.35)
  Top 0.305: LED11.2-DOUT 57.02,108.91 v55.73,108.91 | LED12.4-DIN 39.67,112.04 v39.69,112.06
  Bottom 0.305: v39.69,112.06 39.69,111.03 40.5,110.21 54.42,110.21 v55.73,108.91
N$14  (via drill 0.35)
  Top 0.305: LED7.2-DOUT 75.26,65.8 v73.97,65.8 | LED8.4-DIN 59,72.32 v59.01,72.33
  Bottom 0.305: v73.97,65.8 72.77,67 60.75,67 59.02,68.73 v59.02,72.32 v59.01,72.33
N$15
  Bottom 0.203: U2.17 59.42,6.97 60.53,5.86 63.67,5.86 64.12,5.41 Y1.1 64.12,2.06 C7.1
N$16
  Bottom 0.203: U2.16 58.73,7.57 59.39,7.57 60.73,6.23 66.1,6.23 66.32,6.45 Y1.3 67.75,7.48 C8.1
N$17
  Bottom 0.203: U2.6 55.24,11.85 55.59,12.2 C5.1
N$18
  Bottom 0.203: U2.42 51.06,8.47 50.76,8.77 C6.1
N$19  (via drill 0.35)
  Top 0.305: v43.75,11.8 43.75,8.06 42.05,6.36 42.05,6.34 v42.04,6.34
  Bottom 0.203: SJ1.1 42.56,3.83 42.15,4.23 D2.A
  Bottom 0.305: CN2.1 49.16,16.66 44.3,11.8 v43.75,11.8 | v42.04,6.34 42.04,4.26 D2.A
N$20
  Bottom 0.203: U2.3 53.74,11.97 R2.2
N$21
  Bottom 0.203: U1.4 C2.1
RESET
  Bottom 0.203: R1.1 61.25,8.97 U2.13
USB_D+
  Bottom 0.203: CN1.3 26.7,6.99 27.24,7.53 34.5,7.53 35.61,8.63 38.57,8.63 40.51,10.57 43.69,10.57 48.94,15.82 53.08,15.82 R3.1
USB_D-
  Bottom 0.203: CN1.2 27.35,6.92 27.56,7.13 34.61,7.13 35.73,8.26 38.74,8.26 40.69,10.21 43.88,10.21 47.69,14.02 51.65,14.02 R2.1
VBAT
  Bottom 0.203: D1.C 38.58,2.65 39.39,1.85 | U1.1 44.82,9.78 43.52,8.48 D2.C 40.18,8.48 39.39,7.69 39.39,1.85 | SJ1.2 39.39,1.85
  Bottom 0.305: U1.3 48.26,8.94 48.08,8.76 46.62,8.76 46.38,9 U1.1
VBUS  (via drill 0.35)
  Top 0.203: v50,11.87 v52.47,11.87 52.76,11.58 v55.88,11.58
  Bottom 0.203: CN1.1 28,6.46 28.18,6.64 32.83,6.64 | 32.83,6.64 C1.1 | 32.83,6.64 36.79,6.64 D1.A 37.97,6.9 40.91,9.83 44.01,9.83 47.32,13.14 48.73,13.14 v50,11.87 | U2.2 53.24,11.11 v52.47,11.87 | U2.7 55.74,11.44 v55.88,11.58

### Text on the board
bPlace: 2020 / Coronavirus Pandemic / Quarantine Projects | Tiago Silva